# EAGLE schematic board2 (EAGLE 6.5.0)
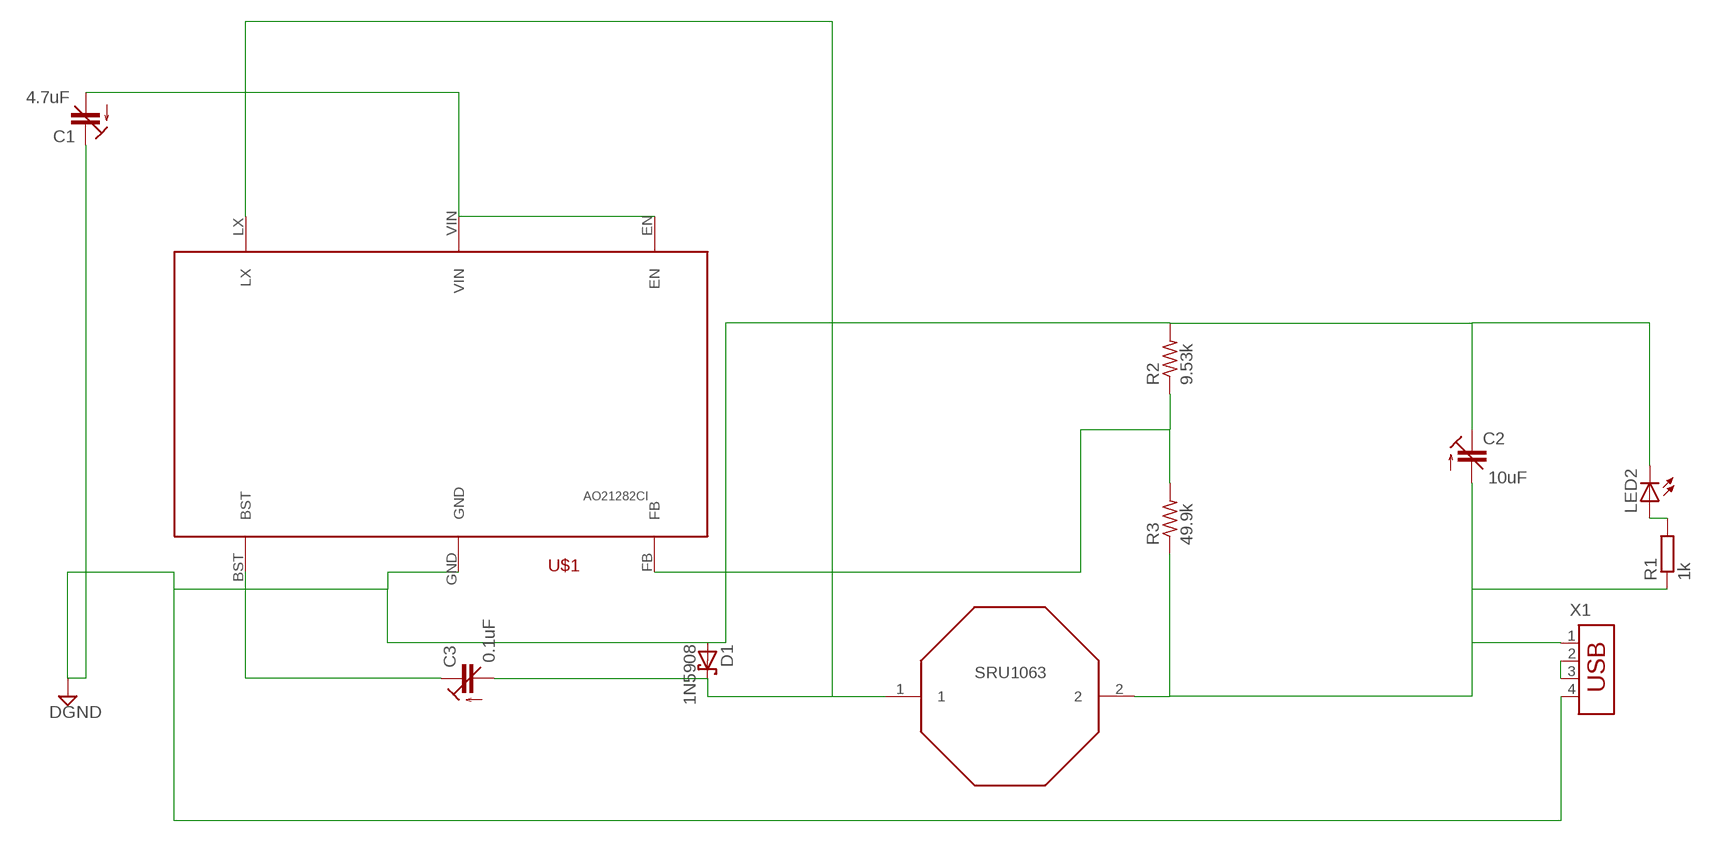
[diagram p0: schematic, sheet 1]

## Parts
C1  4.7uF  C-TRIMM3008  [3008]
C2  10uF  C-TRIMM3008  [3008]
C3  0.1uF  C-TRIMM3008  [3008]
D1  1N5908  [C4111-15]
LED2  LEDSML0603  [SML0603]
R1  1k  R-EU_R1206  [R1206]
R2  9.53k  R-US_M1206  [M1206]
R3  49.9k  R-US_M1206  [M1206]
U$1  AO21282CI  [AO21282CI]
U$2  SRU1063  [SRU1063]
X1  USB-787616  [USB]

## Nets
DGND: C1.+(E) C2.+(E) D1.A LED2.C R2.2 U$1.GND X1.4
N$1: C1.-(A) U$1.EN U$1.VIN
N$2: C3.+(E) U$1.BST
N$3: C3.-(A) D1.C U$1.LX U$2.1
N$4: C2.-(A) R1.1 R3.1 U$2.2 X1.1
N$5: R2.1 R3.2 U$1.FB
N$6: LED2.A R1.2
N$8: X1.2 X1.3

## Library data of the parts
C1-C3 = c-trimm:C-TRIMM: Trimm capacitor; OC_FARNELL: unknown; OC_NEWARK: unknown
D1 = diode:1N5908: DIODE schottky
LED2 = led:LED: LED OSRAM: - CHIPLED LG R971, LG N971, LY N971, LG Q971, LY Q971, LO R971, LY R971 LH N974, LH R974 LS Q976, LO Q976, LY Q976 LO Q996 - Hyper CHIPLED LW Q18S LB Q993, LB Q99A, LB R99A - SideLED LS A670, LO A670, LY A670, LG A670, LP A670 LB A673, LV A673, LT A673, LW A673 LH A674 LY A675 LS A676, LA A676, LO A676, LY A676, LW A676 LS A679, LY A679, LG A679 - Hyper Micro SIDELED® LS Y876, LA Y876, LO Y876, LY Y876 LT Y87S - SmartLED LW L88C, LW L88S LB L89C, LB L89S, LG L890 LS L89K, LO L89K, LY L89K LS L896, LA L896, LO L896, LY L896 - TOPLED LS T670, LO T670, LY T670, LG T670, LP T670 LSG T670, LSP T670, LSY T670, LOP T670, LYG T670 LG T671, LOG T671, LSG T671 LB T673, LV T673, LT T673, LW T673 LH T674 LS T676, LA T676, LO T676, LY T676, LB T676, LH T676, LSB T676, LW T676 LB T67C, LV T67C, LT T67C, LS T67K, LO T67K, LY T67K, LW E67C LS E67B, LA E67B, LO E67B, LY E67B, LB E67C, LV E67C, LT E67C LW T67C LS T679, LY T679, LG T679 LS T770, LO T770, LY T770, LG T770, LP T770 LB T773, LV T773, LT T773, LW T773 LH T774 LS E675, LA E675, LY E675, LS T675 LS T776, LA T776, LO T776, LY T776, LB T776 LHGB T686 LT T68C, LB T68C - Hyper Mini TOPLED® LB M676 - Mini TOPLED Santana® LG M470 LS M47K, LO M47K, LY M47K Source: http://www.osram.convergy.de LUXEON: - LUMILED® LXK2-PW12-R00, LXK2-PW12-S00, LXK2-PW14-U00, LXK2-PW14-V00 LXK2-PM12-R00, LXK2-PM12-S00, LXK2-PM14-U00 LXK2-PE12-Q00, LXK2-PE12-R00, LXK2-PE12-S00, LXK2-PE14-T00, LXK2-PE14-U00 LXK2-PB12-K00, LXK2-PB12-L00, LXK2-PB12-M00, LXK2-PB14-N00, LXK2-PB14-P00, LXK2-PB14-Q00 LXK2-PR12-L00, LXK2-PR12-M00, LXK2-PR14-Q00, LXK2-PR14-R00 LXK2-PD12-Q00, LXK2-PD12-R00, LXK2-PD12-S00 LXK2-PH12-R00, LXK2-PH12-S00 LXK2-PL12-P00, LXK2-PL12-Q00, LXK2-PL12-R00 Source: www.luxeon.com KINGBRIGHT: KA-3528ASYC Source: www.kingbright.com
R1 = rcl:R-EU_: RESISTOR, European symbol
R2 R3 = rcl:R-US_: RESISTOR, American symbol
U$1 = AO21282CI:AO21282CI
U$2 = AO21282CI:SRU1063
X1 = con-amp:USB-787616: AMP connector